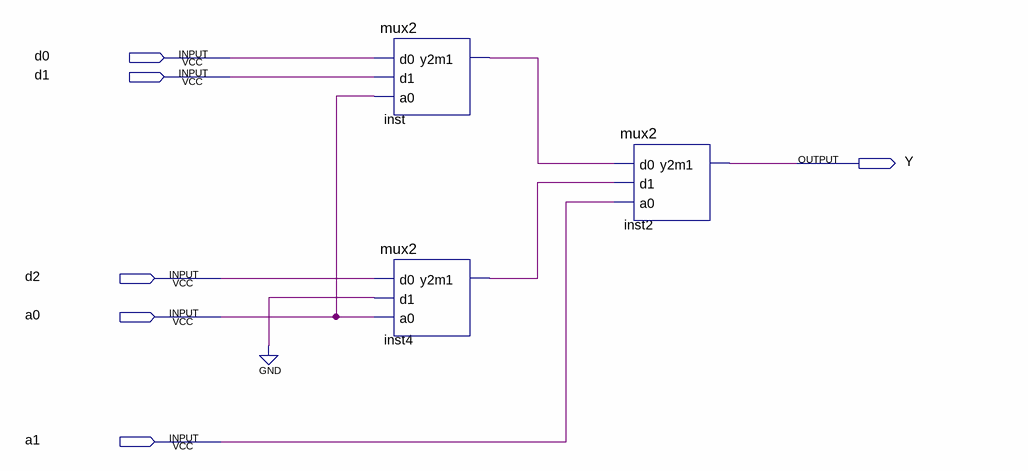
[diagram p0: schematic sheet]
// Quartus schematic mux3.bdf as structural Verilog: 3 symbols, 6 pins
module mux3 (
  input  d0,
  input  d1,
  input  d2,
  input  a0,
  input  a1,
  output Y
);

  wire inst4_y2m1, inst_y2m1;

  mux2 inst (.d0(d0), .d1(d1), .a0(a0), .y2m1(inst_y2m1));
  mux2 inst4 (.d0(d2), .d1(1'b0), .a0(a0), .y2m1(inst4_y2m1));
  mux2 inst2 (.d0(inst_y2m1), .d1(inst4_y2m1), .a0(a1), .y2m1(Y));
endmodule
